# EAGLE design Pi-Display-2 (EAGLE 7.4.0)
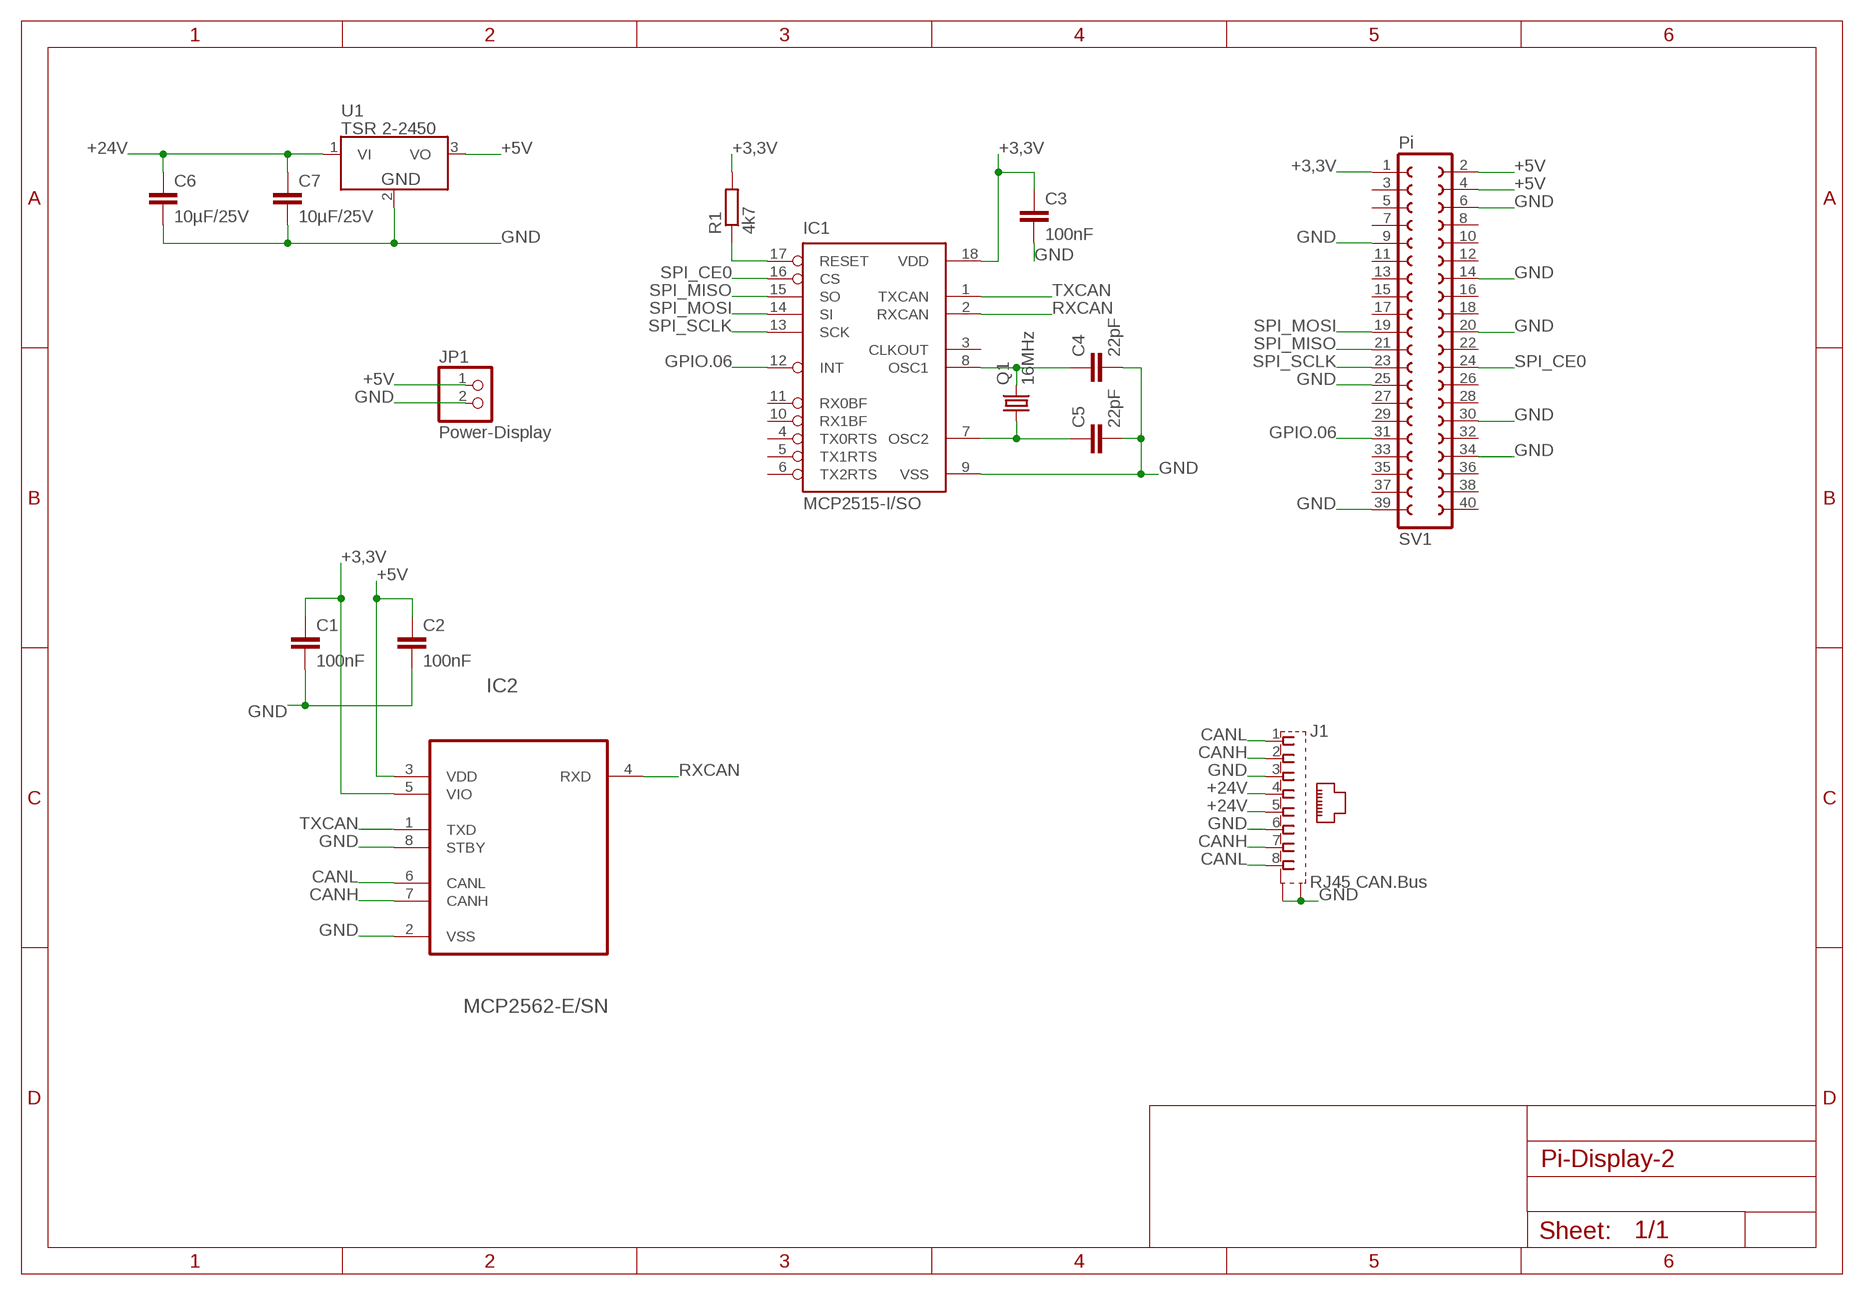
[diagram p0: schematic, sheet 1]

## Parts
C1  100nF  C-EUC1206  [C1206]
C2  100nF  C-EUC1206  [C1206]
C3  100nF  C-EUC1206  [C1206]
C4  22pF  C-EUC1206  [C1206]
C5  22pF  C-EUC1206  [C1206]
C6  10µF/25V  C-EUC1206  [C1206]
C7  10µF/25V  C-EUC1206  [C1206]
IC1  MCP2515-I/SO  [SO18L]
IC2  MCP2562-E/SN  [SO08]
J1  RJ45 CAN.Bus  555141-1  [MEBP_8-8G]
JP1  Power-Display  PINHD-1X2/90  [1X02/90]
Q1  16MHz  CRYSTALHC49UP  [HC49UP]
R1  4k7  R-EU_R1206  [R1206]
SV1  Pi  FE20-2  [FE20-2]
U1  TSR 2-2450  TSR2-2450  [TSR2]

## Nets
+3,3V: C1.1 C3.1 IC1.18(VDD) IC2.5(VIO) R1.2 SV1.1
+5V: C2.1 IC2.3(VDD) JP1.1 SV1.2 SV1.4 U1.3(VO)
+24V [24V]: C6.1 C7.1 J1.4 J1.5 U1.1(VI)
CANH: IC2.7(CANH) J1.2 J1.7
CANL: IC2.6(CANL) J1.1 J1.8
GND: C1.2 C2.2 C3.2 C4.2 C5.2 C6.2 C7.2 IC1.9(VSS) IC2.2(VSS) IC2.8(STBY) J1.3 J1.6 J1.G1(S1) J1.G2(S2) JP1.2 SV1.6 SV1.9 SV1.14 SV1.20 SV1.25 SV1.30 SV1.34 SV1.39 U1.2(GND)
GPIO.06: IC1.12(INT) SV1.31
N$1: C4.1 IC1.8(OSC1) Q1.2
N$2: IC1.17(RESET) R1.1
N$4: C5.1 IC1.7(OSC2) Q1.1
RXCAN: IC1.2(RXCAN) IC2.4(RXD)
SPI_CE0: IC1.16(CS) SV1.24
SPI_MISO: IC1.15(SO) SV1.21
SPI_MOSI: IC1.14(SI) SV1.19
SPI_SCLK: IC1.13(SCK) SV1.23
TXCAN: IC1.1(TXCAN) IC2.1(TXD)
Unconnected: IC1.3(CLKOUT) IC1.4(TX0RTS) IC1.5(TX1RTS) IC1.6(TX2RTS) IC1.10(RX1BF) IC1.11(RX0BF) SV1.3 SV1.5 SV1.7 SV1.8 SV1.10 SV1.11 SV1.12 SV1.13 SV1.15 SV1.16 SV1.17 SV1.18 SV1.22 SV1.26 SV1.27 SV1.28 SV1.29 SV1.32 SV1.33 SV1.35 SV1.36 SV1.37 SV1.38 SV1.40

## Library data of the parts
C1-C7 = rcl:C-EU: CAPACITOR, European symbol
IC1 = mcp2515_2551_2562:MCP2515
IC2 = mcp2515_2551_2562:MCP2562: High-Speed CAN Transceiver,DIP-8
J1 = mebp_8-8g:555141-1: AMP connector Reichelt Bestell-Nr. MEBP 8-8G
JP1 = pinhead:PINHD-1X2: PIN HEADER
Q1 = crystal:CRYSTAL: CRYSTAL; OC_FARNELL: unknown; OC_NEWARK: unknown
R1 = rcl:R-EU_: RESISTOR, European symbol
SV1 = con-lsta:FE20-2: FEMALE HEADER; OC_FARNELL: unknown; OC_NEWARK: unknown
U1 = TSR:TSR2-*: TSR 2 Series, 1 A The new TSR 2 series step-down switching regulators are drop-in replacement for inefficient LMxx linear regulators. A high efficiency up to 96 % allows full load operation up to +67°C ambient temperature without the need of any heat-sink or forced cooling.The TSR 2 switching regulators provide other significant features over linear regulators, i.e. better output accuracy (±2 %), lower standby current of 2 mA and no requirement of external capacitors. The high efficiency and low standby power consumption makes these regulators an ideal solution for many battery powered applications.

## Net classes
1 24V: width 0.813 mm, clearance 0.406 mm

## Board
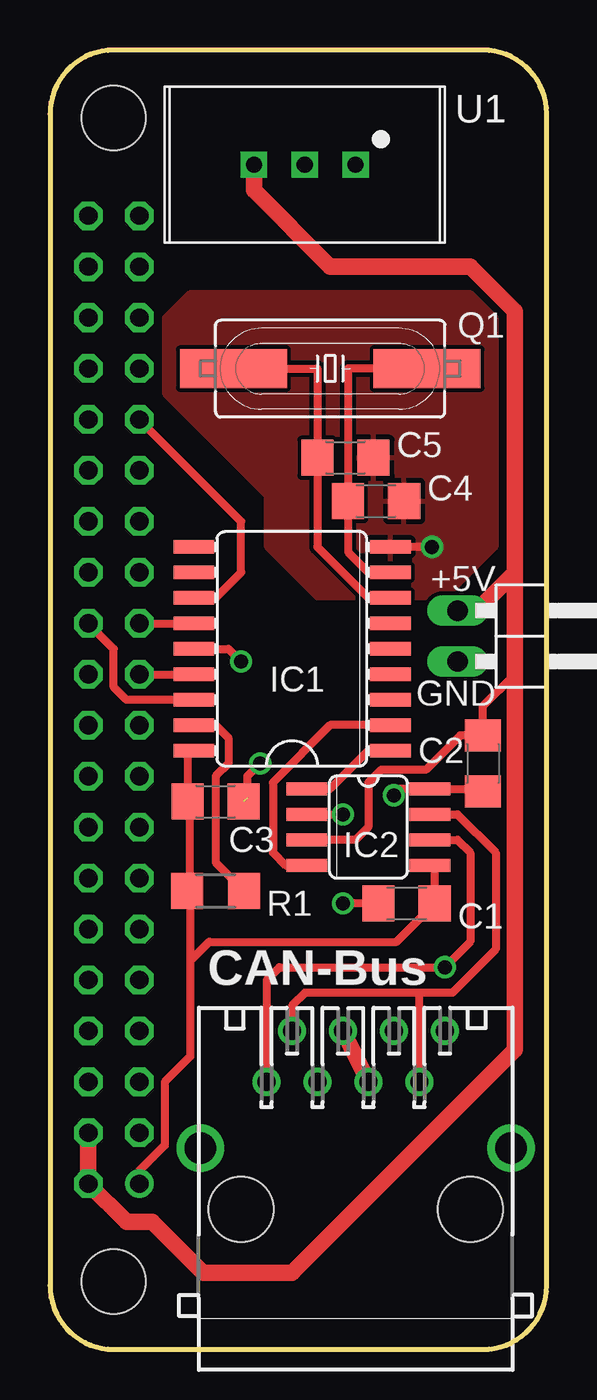
[diagram p1: board, top side]
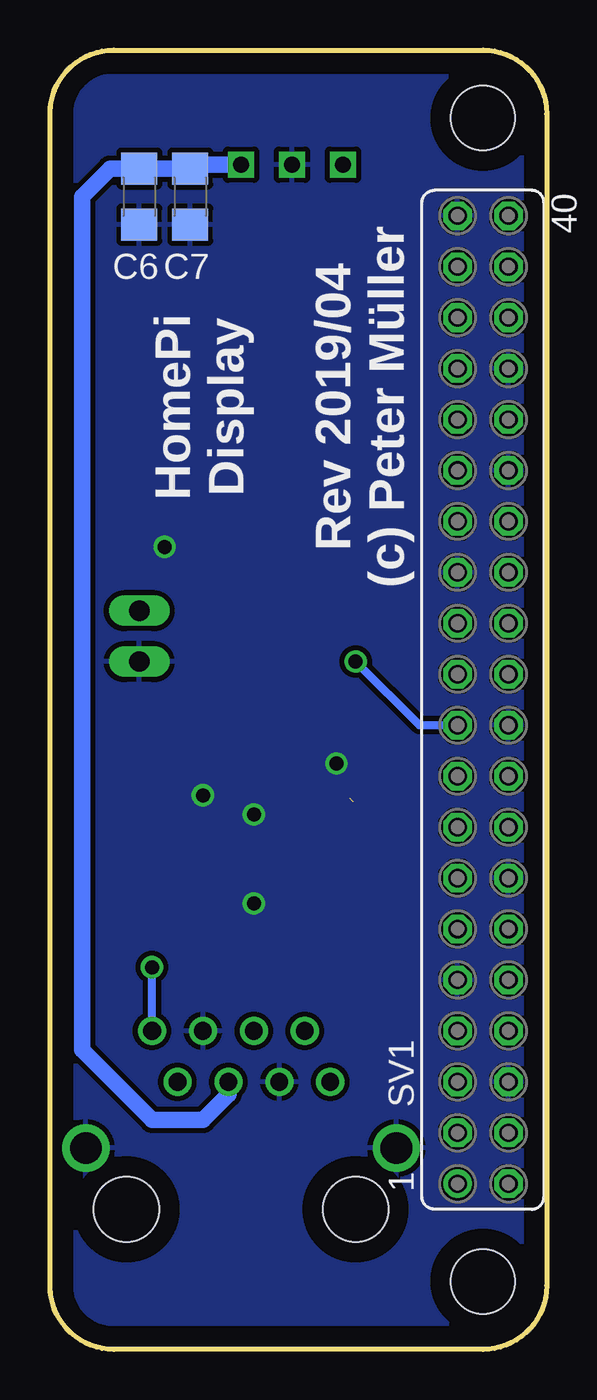
[diagram p2: board, bottom side, seen from below]

Size 24.76 x 64.77 mm. Coordinates in mm from the lower left corner, seen from the top.
Outline: 0,3.17 arc90 3.17,0 21.59,0 arc90 24.76,3.17 24.76,61.59 arc90 21.59,64.77 3.17,64.77 arc90 0,61.59 0,3.17
Copper layers (1*16): Top 0.035mm / dielectric 1.5mm / Bottom 0.035mm
Design rules "allpcb2": minimum track width 8mil, minimum drill 0.5mm, track to track 8mil, track to pad 8mil, pad to pad 8mil, via to via 8mil, smd to smd 6mil, copper to edge 40mil, drill to drill 8mil, minimum pad ring 10mil, minimum via ring 8mil, stop-mask expansion 0.1mm, vias tented up to drill 0mil, thermal gap 10mil
Holes 3.2 mm at 3.17,3.38 3.17,61.39

### Footprints (pad centres in the part's own frame; a part is rotated, then mirrored left to right if it is on the bottom)
C1206 = smd 1.6 x 1.8: 1 -1.4,0; 2 1.4,0
SO18L = smd 0.66 x 2.032: 1 -5.08,-4.902; 2 -3.81,-4.902; 3 -2.54,-4.902; 4 -1.27,-4.902; 5 0,-4.902; 6 1.27,-4.902; 7 2.54,-4.902; 8 3.81,-4.902; 9 5.08,-4.902; 10 5.08,4.902; 11 3.81,4.902; 12 2.54,4.902; 13 1.27,4.902; 14 0,4.902; 15 -1.27,4.902; 16 -2.54,4.902; 17 -3.81,4.902; 18 -5.08,4.902
SO08 = smd 0.66 x 2.032: 1 -1.905,-3.073; 2 -0.635,-3.073; 3 0.635,-3.073; 4 1.905,-3.073; 5 1.905,3.073; 6 0.635,3.073; 7 -0.635,3.073; 8 -1.905,3.073
MEBP_8-8G = drill 0.889: 1 -4.445,6.35; 2 -3.175,8.89; 3 -1.905,6.35; 4 -0.635,8.89; 5 0.635,6.35; 6 1.905,8.89; 7 3.175,6.35; 8 4.445,8.89 | drill 1.575 pad 2.184: G1 -7.745,3.05; G2 7.745,3.05 | hole 3.251: -5.715,0; 5.715,0
1X02/90 = drill 1.016 long: 1 -1.27,-3.81; 2 1.27,-3.81
HC49UP = smd 5.334 x 1.93: 1 -4.826,0; 2 4.826,0
R1206 = smd 1.6 x 1.803: 1 -1.422,0; 2 1.422,0
FE20-2 = drill 0.914: 1 -24.13,1.27 | drill 0.914 octagon: 2 -24.13,-1.27; 3 -21.59,1.27; 4 -21.59,-1.27; 5 -19.05,1.27; 6 -19.05,-1.27; 7 -16.51,1.27; 8 -16.51,-1.27; 9 -13.97,1.27; 10 -13.97,-1.27; 11 -11.43,1.27; 12 -11.43,-1.27; 13 -8.89,1.27; 14 -8.89,-1.27; 15 -6.35,1.27; 16 -6.35,-1.27; 17 -3.81,1.27; 18 -3.81,-1.27; 19 -1.27,1.27; 20 -1.27,-1.27; 21 1.27,1.27; 22 1.27,-1.27; 23 3.81,1.27; 24 3.81,-1.27; 25 6.35,1.27; 26 6.35,-1.27; 27 8.89,1.27; 28 8.89,-1.27; 29 11.43,1.27; 30 11.43,-1.27; 31 13.97,1.27; 32 13.97,-1.27; 33 16.51,1.27; 34 16.51,-1.27; 35 19.05,1.27; 36 19.05,-1.27; 37 21.59,1.27; 38 21.59,-1.27; 39 24.13,1.27; 40 24.13,-1.27
TSR2 = drill 0.8 square: 1 -2.54,0; 2 0,0; 3 2.54,0

### Placement (x,y rotation side)
C1  17.78,22.22 180 top
C2  21.59,29.21 270 top
C3  8.26,27.3 0 top
C4  16.26,42.29 0 top
C5  14.73,44.45 0 top
C6  20.32,57.47 270 bottom
C7  17.78,57.47 270 bottom
IC1  12.06,34.93 90 top
IC2  15.88,26.04 270 top
J1  15.24,6.99 0 top
JP1  24.13,35.56 270 top
Q1  13.97,48.9 0 top
R1  8.26,22.86 180 top
SV1  3.17,32.39 90 bottom
U1  12.7,59.05 180 top

### Tracks (layer width: path | path; a pad name or v marks a point on that pad's centre or on a via)
+3,3V
  Top 0.406: IC1.18 6.86,29.84 C3.1 6.99,27.3 6.99,23.49 | SV1.1 4.45,8.89 5.71,10.16 5.71,13.34 6.99,14.61 6.99,19.37 | 6.99,23.49 6.99,19.37 | IC2.5 19.18,24.13 C1.1 17.27,20.32 7.94,20.32 6.99,19.37 | 6.99,23.49 R1.2
+5V
  Top 0.406: IC2.3 15.24,25.4 15.88,26.04 15.88,28.26 16.51,28.89 18.73,28.89 20.45,30.61 C2.1 21.59,32.07 23.18,33.66 | 23.05,30.61 23.18,30.48
  Top 0.813: U1.3 10.16,57.79 13.97,53.98 20.95,53.98 23.18,51.75 23.18,38.73 | 23.18,38.73 23.18,33.66 23.18,30.48 23.18,14.92 12.06,3.81 7.62,3.81 5.08,6.35 3.81,6.35 SV1.2 SV1.4 | JP1.1 21.27,36.83 23.18,38.73
+24V
  Top 0.813: J1.4 J1.5
  Bottom 0.813: J1.5 15.88,12.7 17.14,11.43 19.68,11.43 23.18,14.92 23.18,57.47 21.78,58.87 C6.1 C7.1 18.23,59.05 U1.1
CANH
  Top 0.406: J1.2 12.06,17.14 12.7,17.78 18.41,17.78 | 18.41,17.78 20.07,17.78 22.22,19.94 22.22,24.76 20.32,26.67 IC2.7 | J1.7 18.41,17.78
CANL  (via drill 0.7)
  Top 0.406: J1.1 10.79,18.41 11.43,19.05 v19.68,19.05 20.95,20.32 20.95,24.76 20.32,25.4 IC2.6
  Bottom 0.406: J1.8 v19.68,19.05
GND  (via drill 0.7)  (1 unrouted)
  Top 0.406: v19.05,40.01 IC1.9 | IC2.2 v14.61,26.67 | C1.2 v14.61,22.22 | C2.2 21.08,27.94 IC2.8 17.46,27.94 v17.14,27.62 | 9.84,27.49 9.84,28.57 v10.48,29.21
  pour Bottom (isolate 0.254): 0.64,3.17 arc90 3.17,0.64 21.59,0.64 arc90 24.13,3.17 24.13,61.59 arc90 21.59,64.13 3.17,64.13 arc90 0.64,61.59
  pour Top: 5.71,51.44 6.99,52.71 20.95,52.71 22.22,51.44 22.22,40.01 19.68,37.47 13.34,37.47 10.79,40.01 10.79,42.55 5.71,47.62
GPIO.06
  Top 0.406: IC1.12 8.26,37.47 9.53,38.73 9.53,41.27 SV1.31
N$1
  Top 0.406: Q1.2 14.86,48.9 C4.1 14.86,39.75 15.88,38.73 IC1.8
N$2
  Top 0.406: IC1.17 8.26,31.11 8.89,30.48 8.89,29.21 8.26,28.57 8.26,24.28 R1.1
N$4
  Top 0.406: Q1.1 13.33,48.9 C5.1 13.33,40.01 15.88,37.47 IC1.7
RXCAN
  Top 0.406: IC1.2 13.97,31.11 11.11,28.26 11.11,24.76 11.75,24.13 IC2.4
SPI_CE0
  Top 0.406: IC1.16 3.81,32.39 3.17,33.02 3.17,34.93 SV1.24
SPI_MISO
  Top 0.406: SV1.21 IC1.15
SPI_MOSI  (via drill 0.7)
  Top 0.406: IC1.14 8.89,34.93 v9.53,34.29
  Bottom 0.406: v9.53,34.29 6.35,31.11 SV1.19
SPI_SCLK
  Top 0.406: SV1.23 IC1.13
TXCAN
  Top 0.406: IC1.1 15.88,29.84 13.97,27.94 IC2.1

### Text on the board
tNames: +5V | GND | CAN-Bus
bNames: HomePi / Display / / Rev 2019/04 / (c) Peter Müller